# Altium schematic sheet VARIOS.SchDoc: Varios
size A4; Engineer: Nuria Parra; Organization: Altium Limited; Address1: L3, 12a Rodborough Rd; Address2: Frenchs Forest; Address3: NSW; Address4: Australia 2086; Revision: 1
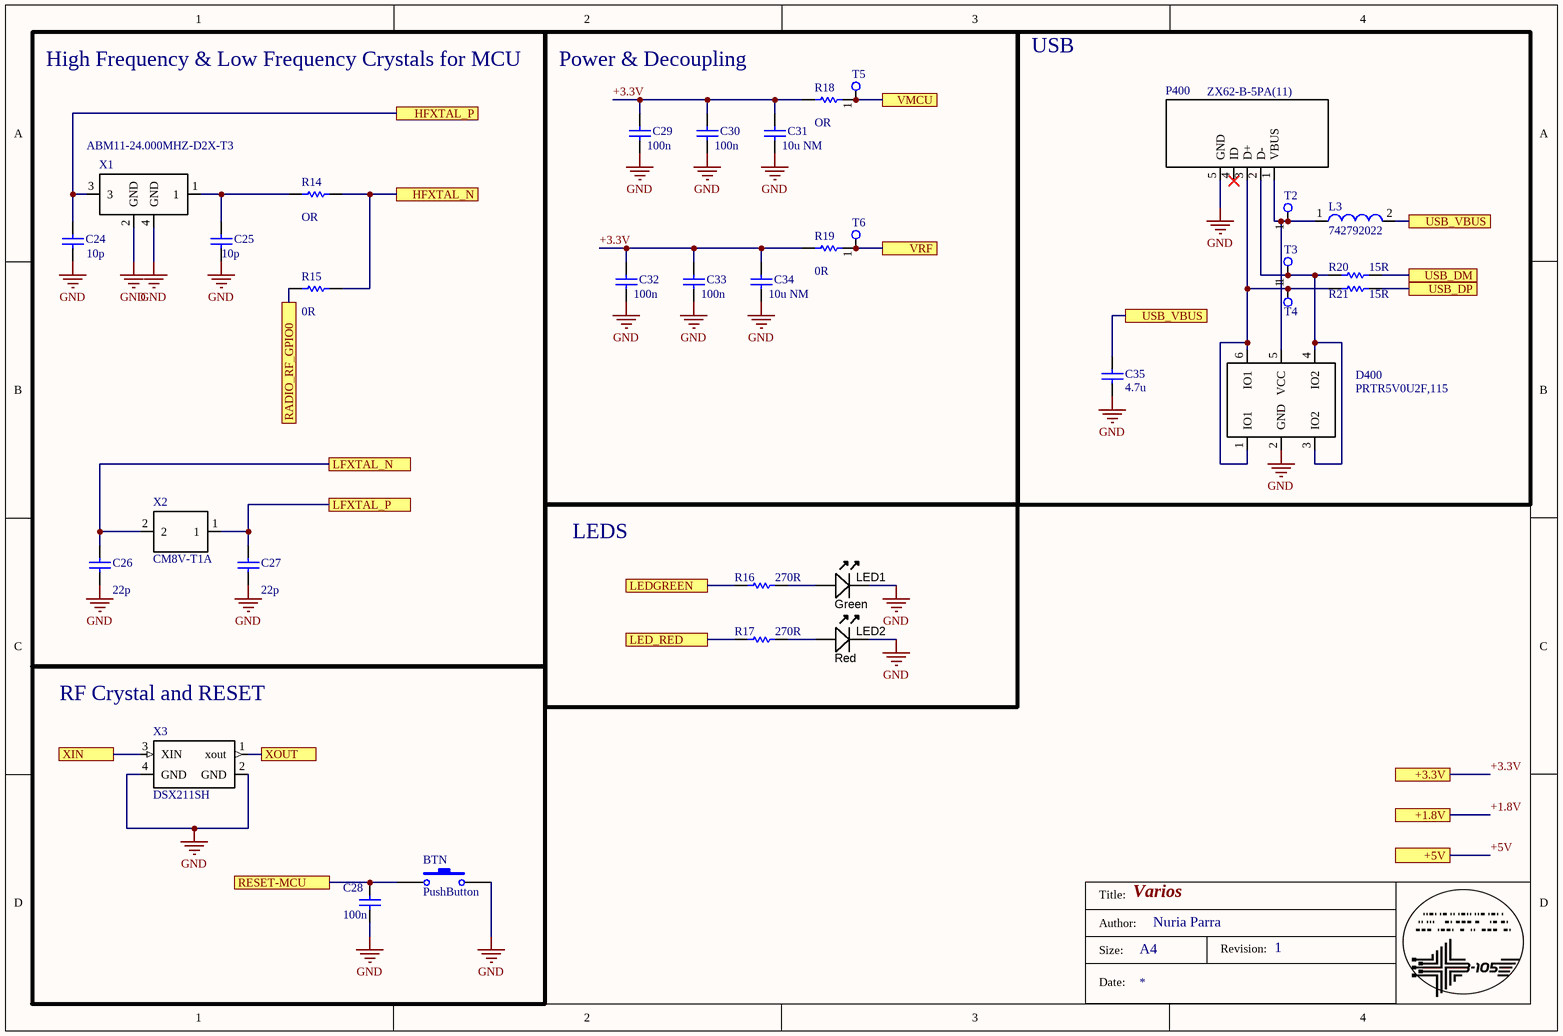
[diagram p0: VARIOS.SchDoc]

## Parts
BTN  PushButton  [Push button SMD 2 leads]
C24  value 10p  [0603 Cap]  (hidden comment: Cap)
C25  value 10p  [0603 Cap]  (hidden comment: Cap)
C26  value 22p  [0603 Cap]  (hidden comment: Cap)
C27  value 22p  [0603 Cap]  (hidden comment: Cap)
C28  value 100n  [0603 Cap]  (hidden comment: Cap)
C29  value 100n  [0603 Cap]  (hidden comment: Cap)
C30  value 100n  [0603 Cap]  (hidden comment: Cap)
C31  value 10u NM  [0603 Cap]  (hidden comment: Cap)
C32  value 100n  [0603 Cap]  (hidden comment: Cap)
C33  value 100n  [0603 Cap]  (hidden comment: Cap)
C34  value 10u NM  [0603 Cap]  (hidden comment: Cap)
C35  value 4.7u  [0603 Cap]  (hidden comment: Cap)
D400  PRTR5V0U2F,115  [PRTR5V0U2F,115]
L3  742792022  [ferritel3]
LED1  Green  [LED-0603-RED]
LED2  Red  [LED-0603-RED]
P400  ZX62-B-5PA(11)  [ZX62-B-5PA(11)]
R14  value OR  [0603 Res]  (hidden comment: Res)
R15  value 0R  [0603 Res]  (hidden comment: Res)
R16  value 270R  [0603 Res]  (hidden comment: Res)
R17  value 270R  [0603 Res]  (hidden comment: Res)
R18  value OR  [0603 Res]  (hidden comment: Res)
R19  value 0R  [0603 Res]  (hidden comment: Res)
R20  value 15R  [0603 Res]  (hidden comment: Res)
R21  value 15R  [0603 Res]  (hidden comment: Res)
T2  testpoint  [testpoint]  (value not drawn)
T3  testpoint  [testpoint]  (value not drawn)
T4  testpoint  [testpoint]  (value not drawn)
T5  testpoint  [testpoint]  (value not drawn)
T6  testpoint  [testpoint]  (value not drawn)
X1  ABM11-24.000MHZ-D2X-T3  [abm]
X2  CM8V-T1A  [CM8V-T1A]
X3  DSX211SH  [DSX211SH]

## Blocks framed on the sheet
High Frequency & Low Frequency Crystals for MCU: C24-C27 R14 R15 X1 X2
Power & Decoupling: C29-C34 R18 R19 T5 T6
USB: C35 D400 L3 P400 R20 R21 T2-T4
LEDS: LED1 LED2 R16 R17
RF Crystal and RESET: BTN C28 X3

## Ports
+1.8V, +3.3V, +5V, HFXTAL_N, HFXTAL_P, LED_RED, LEDGREEN, LFXTAL_N, LFXTAL_P, RADIO_RF_GPIO0, RESET-MCU, USB_DM, USB_DP, USB_VBUS, VMCU, VRF, XIN, XOUT

## Nets
GND: BTN.2 C24.1 C25.1 C26.1 C27.1 C28.1 C29.1 C30.1 C31.1 C32.1 C33.1 C34.1 C35.2 D400.2(GND) LED1.K LED2.K P400.5(GND) X1.2(GND) X1.4(GND) X3.2(GND) X3.4(GND)
+1.8V: port +1.8V
+3.3V: C29.2 C30.2 C31.2 C32.2 C33.2 C34.2 R18.1 R19.1 ; port +3.3V
+5V: port +5V
HFXTAL_N: R14.2 R15.2 ; port HFXTAL_N
HFXTAL_P: C24.2 X1.3 ; port HFXTAL_P
LED_RED: R17.2 ; port LED_RED
LEDGREEN: R16.2 ; port LEDGREEN
LFXTAL_N: C26.2 X2.2 ; port LFXTAL_N
LFXTAL_P: C27.2 X2.1 ; port LFXTAL_P
RADIO_RF_GPIO0: R15.1 ; port RADIO_RF_GPIO0
RESET-MCU: BTN.1 C28.2 ; port RESET-MCU
USB_DM: R20.1 ; port USB_DM
USB_DP: R21.1 ; port USB_DP
USB_VBUS: C35.1 L3.2 ; port USB_VBUS
VMCU: R18.2 T5.1(TP) ; port VMCU
VRF: R19.2 T6.1(TP) ; port VRF
XIN: X3.3(XIN) ; port XIN
XOUT: X3.1(xout) ; port XOUT
NetC25_2: C25.2 R14.1 X1.1
NetD400_1: D400.1(IO1) D400.6(IO1) P400.3(D+) R21.2 T4.1(TP)
NetD400_3: D400.3(IO2) D400.4(IO2) P400.2(D-) R20.2 T3.1(TP)
NetD400_5: D400.5(VCC) L3.1 P400.1(VBUS) T2.1(TP)
NetLED1_A: LED1.A R16.1
NetLED2_A: LED2.A R17.1

Not connected (* = marked no-connect by the designer): P400 4(ID)*

## Notes on the sheet
- Title:
- Size:
- Author:
- Date:
- A4
- Revision:

## Library data of the parts
LED1 = LED_SMD_Green_0603_570nm: LED 0603 SMD Green 570nm 50mcd 20mA; Manufacturer 1: Kingbright Company LLC; Manufacturer Part Number 1: APT1608CGCK; Material: AlGaInP; Ratings: 20mcd min; 50 mcd typ; 570 nm; Voltage - Forward (Vf) Typ: 2.1V; Viewing Angle: 120°; Lens Style/Size: Rectangle with Flat Top, 1.1mm x 0.8mm; Voltage - Forward (Vf) @ 10mA: 2.0V; SCDType: source; Wavelength - Peak: 574nm; Lens Type: Clear; Package / Case: 0603 (1608 metric); Color: Green; Current - Test: 20mA; Supplier 1: Digi-Key; Supplier Part Number 1: 754-1116-1-ND; RoHS 1: RoHS Compliant; Wavelength - Dominant: 570nm; ComponentLink1Description: DataSheet; ComponentLink1URL: http://www.us.kingbright.com/images/catalog/SPEC/APT1608CGCK.pdf
LED2 = LED_SMD_Red_0603_220mcd: LED 0603 SMD Hyper Red 630nm 220mcd 20mA; Manufacturer 1: Kingbright Company LLC; Manufacturer Part Number 1: APT1608SURCK; Material: AlGaInP on GaAs; Ratings: 220 mcd; 630 nm; Voltage - Forward (Vf) Typ: 1.95V; Voltage - Forward (Vf) @ 10mA: 1.9V; SCDType: source; Package / Case: 0603 (1608 metric); Supplier 1: Digi-Key; Supplier Part Number 1: 754-1123-1-ND; ComponentLink1Description: DataSheet; ComponentLink1URL: http://www.us.kingbright.com/images/catalog/SPEC/APT1608CGCK.pdf